# EAGLE design odbiornik (EAGLE 6.4)
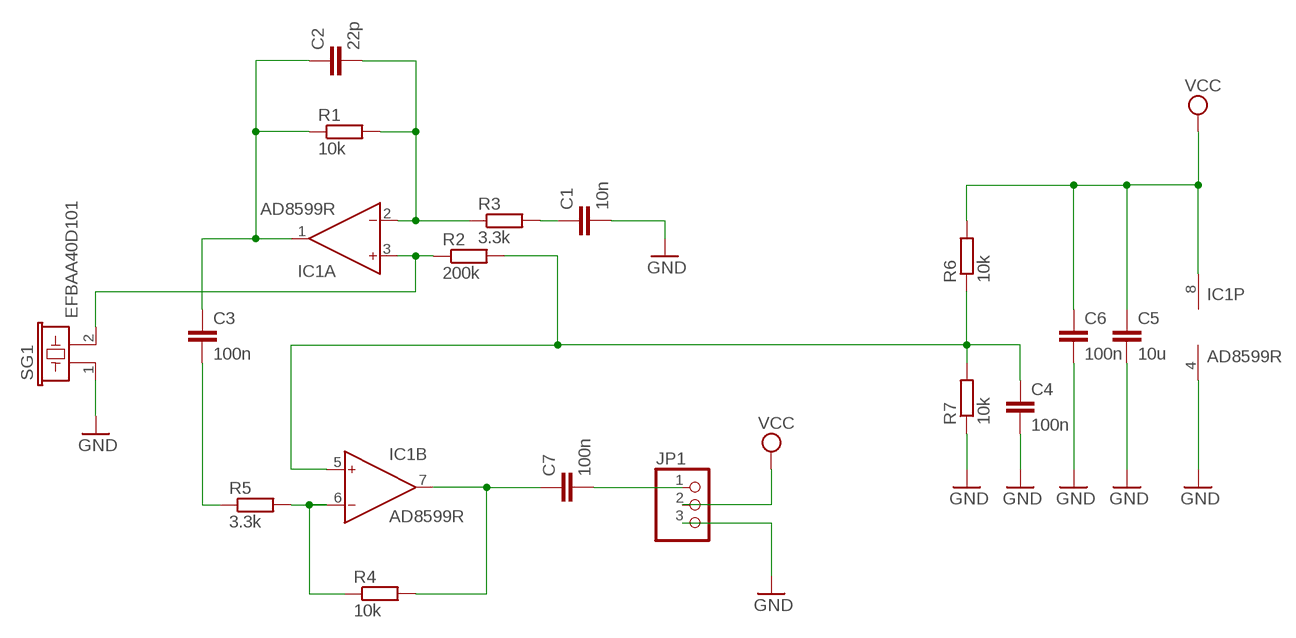
[diagram p0: schematic, sheet 1]

## Parts
C1  10n  C-EUC1206K  [C1206K]
C2  22p  C-EUC1206K  [C1206K]
C3  100n  C-EUC1206K  [C1206K]
C4  100n  C-EUC1206K  [C1206K]
C5  10u  C-EUC1206K  [C1206K]
C6  100n  C-EUC1206  [C1206]
C7  100n  C-EUC1206  [C1206]
IC1  AD8599R  [SO8]
JP1  PINHD-1X3  [1X03]
R1  10k  R-EU_R0805  [R0805]
R2  200k  R-EU_R0805  [R0805]
R3  3.3k  R-EU_R0805  [R0805]
R4  10k  R-EU_R0805  [R0805]
R5  3.3k  R-EU_R0805  [R0805]
R6  10k  R-EU_R0805  [R0805]
R7  10k  R-EU_R0805  [R0805]
SG1  EFBAA40D101  [EFBAA40D101]

## Nets
GND: C1.2 C4.2 C5.2 C6.2 IC1.4(P:V-) JP1.3 R7.1 SG1.1
N$1: C7.2 JP1.1
N$2: C2.2 IC1.2(A:IN-) R1.2 R3.1
N$3: C1.1 R3.2
N$4: IC1.6(B:IN-) R4.1 R5.2
N$5: C7.1 IC1.7(B:OUT) R4.2
N$6: C3.2 R5.1
N$7: IC1.3(A:IN+) R2.1 SG1.2
N$8: C2.1 C3.1 IC1.1(A:OUT) R1.1
N$9: C4.1 IC1.5(B:IN+) R2.2 R6.1 R7.2
VCC: C5.1 C6.1 IC1.8(P:V+) JP1.2 R6.2

## Library data of the parts
C1-C7 = resistor:C-EU: CAPACITOR, European symbol
IC1 = analog-devices:AD8599: Single and Dual, Ultralow Distortion, Ultralow Noise Op Amps Source: http://www.analog.com/static/imported-files/data_sheets/AD8597_8599.pdf; MPN: AD8599ARZ; OC_FARNELL: 1438872; OC_NEWARK: 34M5072
JP1 = pinhead:PINHD-1X3: PIN HEADER
R1-R7 = resistor:R-EU_: RESISTOR, European symbol
SG1 = buzzer:EFB?: Piezoelectric Acoustic Transducer Source: Panbasonic .. 2SC1685.pdf; OC_FARNELL: unknown; OC_NEWARK: unknown

## Board
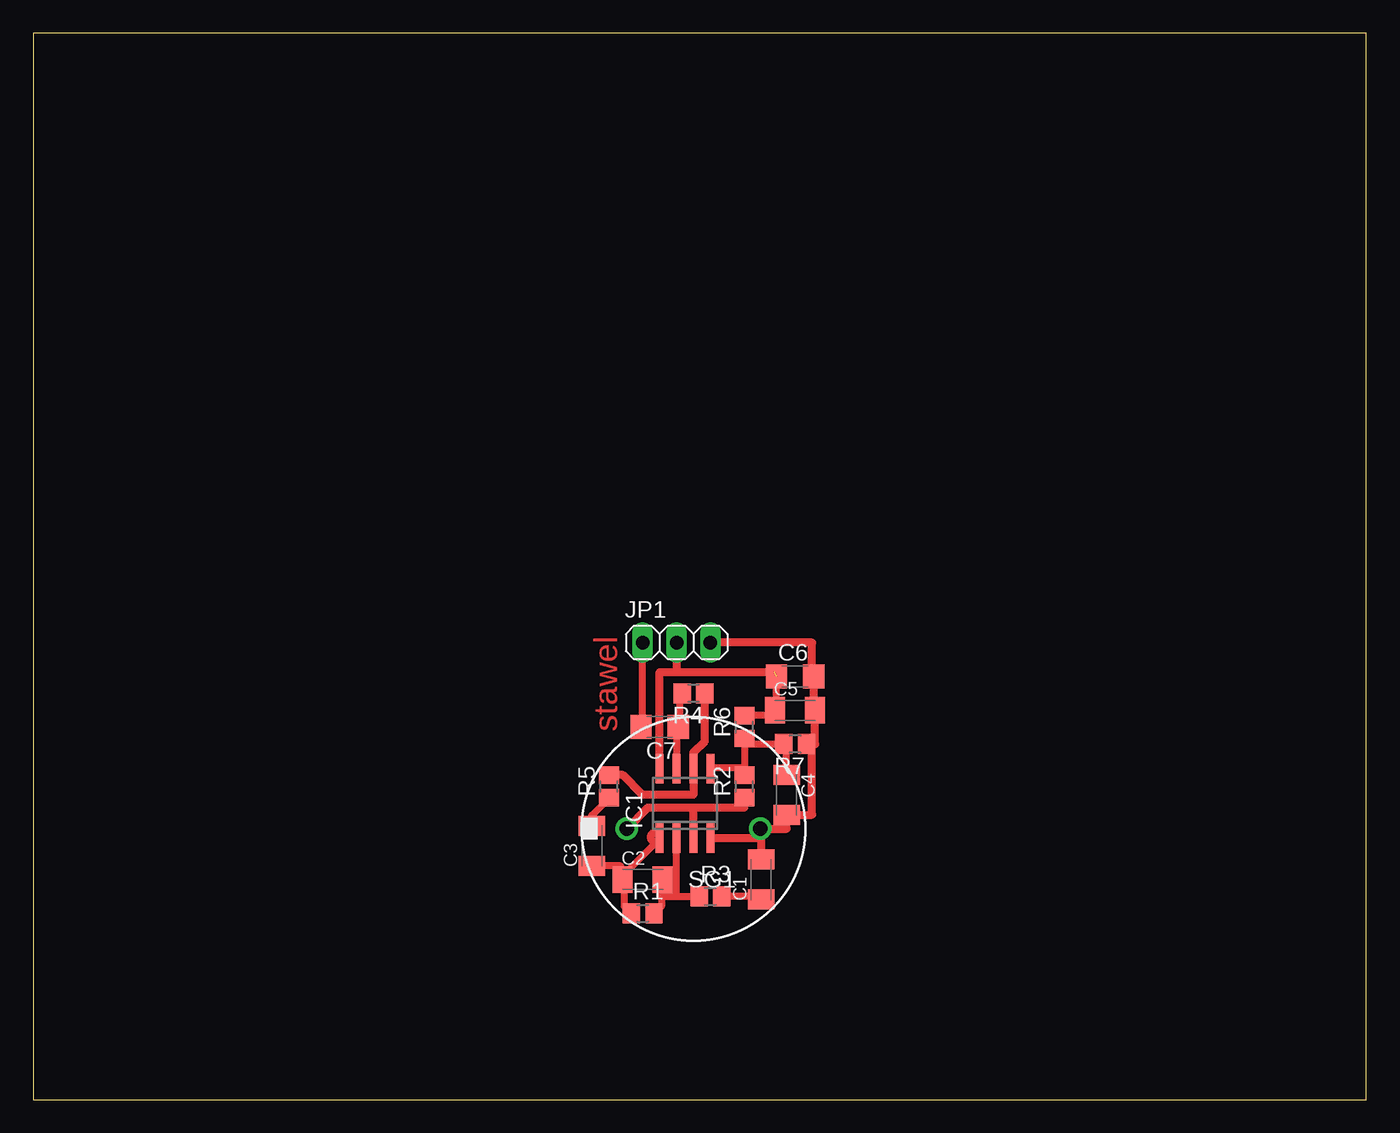
[diagram p1: board, top side]

Size 100 x 80 mm. Coordinates in mm from the lower left corner, seen from the top.
Outline: 0,0 100,0 100,80 0,80 0,0
Copper layers (1*16): Top 0.035mm / dielectric 1.5mm / Bottom 0.035mm
Design rules "default *": minimum track width 20mil, minimum drill 24mil, track to track 8mil, track to pad 8mil, pad to pad 8mil, via to via 8mil, smd to smd 8mil, copper to edge 40mil, drill to drill 8mil, minimum pad ring 10mil, minimum via ring 8mil, stop-mask expansion 4mil, vias tented up to drill 0mil, thermal gap 10mil

### Footprints (pad centres in the part's own frame; a part is rotated, then mirrored left to right if it is on the bottom)
C1206K = smd 1.5 x 2: 1 -1.5,0; 2 1.5,0
C1206 = smd 1.6 x 1.8: 1 -1.4,0; 2 1.4,0
SO8 = smd 0.6 x 2.2: 1 -1.905,-2.6; 2 -0.635,-2.6; 3 0.635,-2.6; 4 1.905,-2.6; 5 1.905,2.6; 6 0.635,2.6; 7 -0.635,2.6; 8 -1.905,2.6
1X03 = drill 1.016 long: 1 -2.54,0; 2 0,0; 3 2.54,0
R0805 = smd 1.3 x 1.5: 1 -0.85,0; 2 0.85,0
EFBAA40D101 = drill 1.1 pad 1.676: 1 -5,0; 2 5,0

### Placement (x,y rotation side)
C1  54.61,16.51 90 top
C2  45.72,16.51 0 top
C3  41.91,19.05 90 top
C4  56.52,22.86 270 top
C5  57.15,29.21 0 top
C6  57.15,31.75 0 top
C7  46.99,27.94 180 top
IC1  48.9,22.23 0 top
JP1  48.26,34.29 0 top
R1  45.72,13.97 0 top
R2  53.34,23.5 90 top
R3  50.8,15.24 0 top
R4  49.53,30.48 180 top
R5  43.18,23.5 90 top
R6  53.34,27.94 90 top
R7  57.15,26.67 180 top
SG1  49.53,20.32 180 top

### Tracks (layer width: path | path; a pad name or v marks a point on that pad's centre or on a via)
GND
  Top 0.508: 56.52,21.34 C4.2 | 50.8,19.68 IC1.4 | 58.42,31.88 C6.2 | 58.04,26.54 R7.1
  Top 0.61: 58.42,26.67 58.42,21.36 C4.2 56.52,20.32 54.61,20.32 | 58.42,26.67 R7.1 | 58.42,26.67 58.65,26.67 C5.2 58.55,29.21 C6.2 | 58.42,31.88 58.42,34.29 JP1.3 | IC1.4 54.53,19.62 SG1.1 54.61,20.32 | 54.61,20.32 C1.2
N$1
  Top 0.508: JP1.1 45.72,28.07 C7.2
N$2
  Top 0.508: 47.12,15.24 47.12,16.51 C2.2 | 47.12,15.24 47.12,14.48 46.61,13.97 R1.2 | 47.12,15.24 48.26,15.24 | 48.26,15.24 R3.1 | 48.26,15.24 IC1.2
N$3
  Top 0.508: R3.2 54.61,15.24 C1.1
N$4
  Top 0.61: R5.2 44.23,24.34 45.72,22.86 49.53,22.86 IC1.6 49.53,26.04 50.38,26.89 R4.1
N$5
  Top 0.508: R4.2 48.64,30.48 48.51,30.35 48.51,27.94 C7.1 48.26,27.81 IC1.7
N$6
  Top 0.508: C3.2 41.91,21.34 43.18,22.61 R5.1
N$7
  Top 0.61: SG1.2 46.12,21.91 49.53,21.91 | 49.53,21.91 53.34,21.91 R2.1 | IC1.3 49.53,21.91
N$8
  Top 0.508: R1.1 44.83,13.97 44.32,14.48 44.32,16.51 C2.1 | C3.1 41.91,17.53 44.07,17.53 44.07,16.64 C2.1 | IC1.1 46.99,19.56 44.2,16.76 C2.1
N$9
  Top 0.508: C4.1 56.52,26.54 56.39,26.67 R7.2 53.47,26.67 R6.1 R2.2 53.21,24.89 50.8,24.89 IC1.5
VCC  (1 unrouted)
  Top 0.508: R6.2 53.34,28.83 55.63,28.83 55.63,29.21 C5.1 55.75,29.34 C6.1
  Top 0.61: IC1.8 46.99,32.07 48.26,32.07 | 48.26,32.07 55.56,32.07 | JP1.2 48.26,32.07
(copper drawn outside any net)
  shapes: Top circle x1

### Text on the board
Top: stawel